# Altium schematic sheet sensors.SchDoc
size Letter
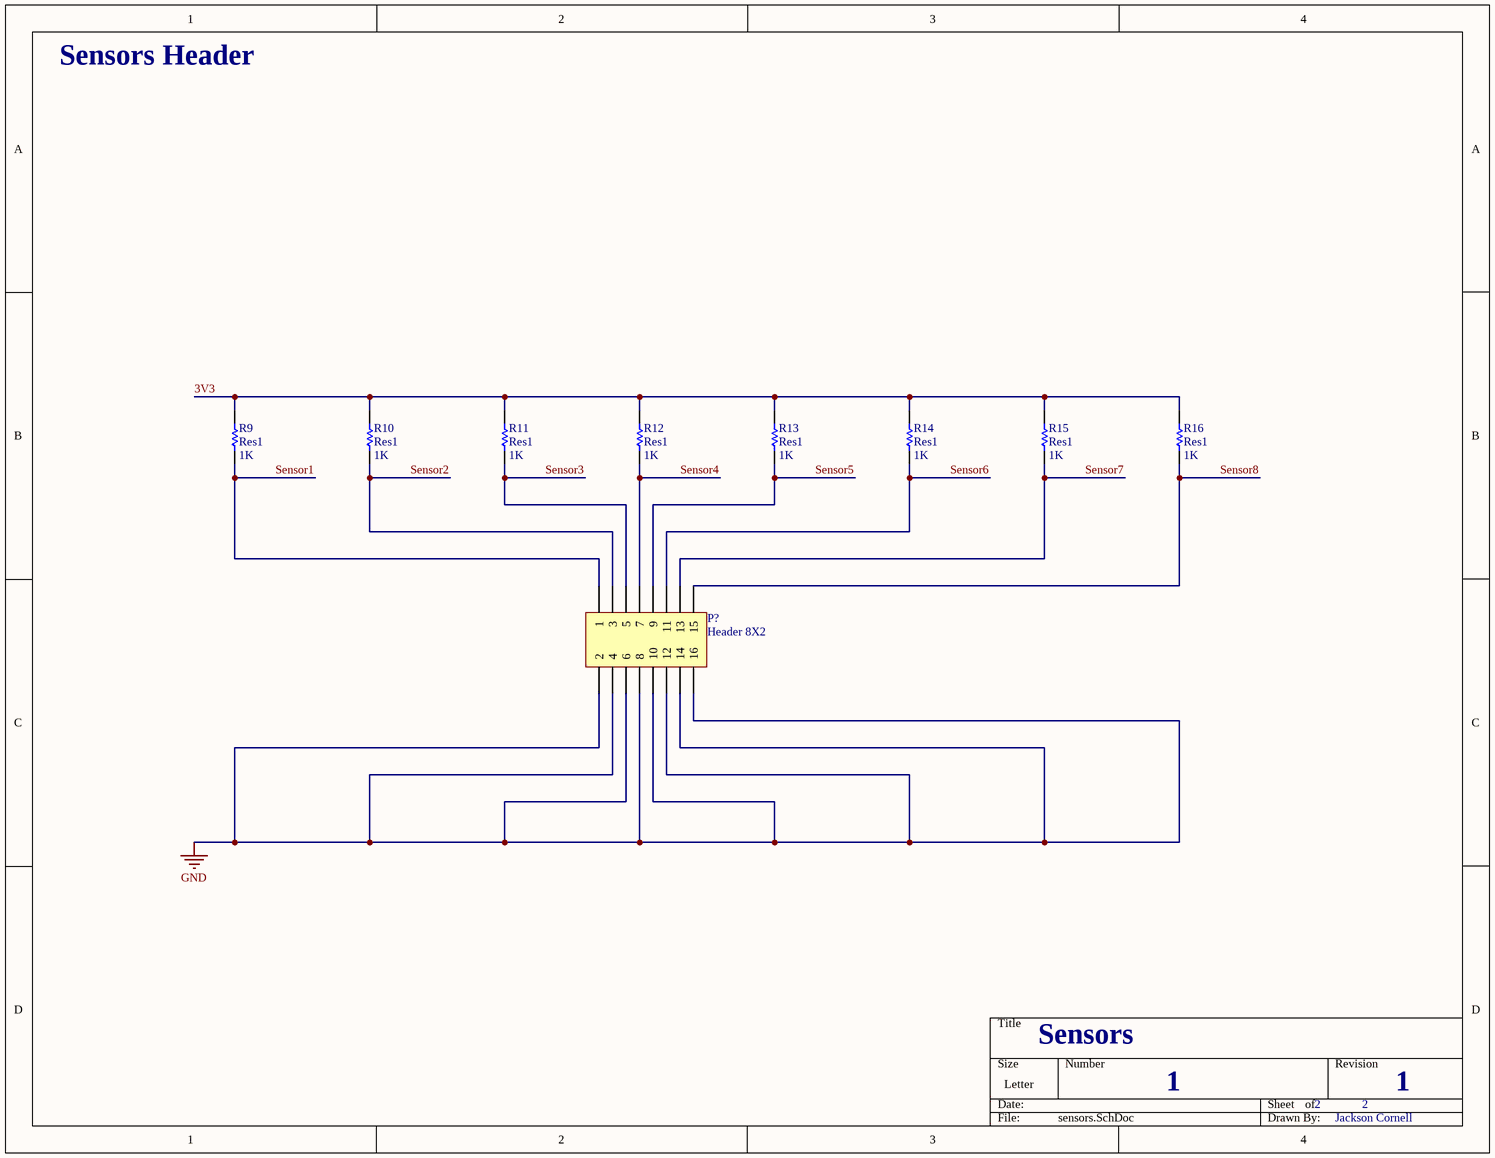
[diagram p0: sensors.SchDoc]

## Parts
P?  Header 8X2  [HDR2X8]
R9  Res1  value 1K  [AXIAL-0.3]
R10  Res1  value 1K  [AXIAL-0.3]
R11  Res1  value 1K  [AXIAL-0.3]
R12  Res1  value 1K  [AXIAL-0.3]
R13  Res1  value 1K  [AXIAL-0.3]
R14  Res1  value 1K  [AXIAL-0.3]
R15  Res1  value 1K  [AXIAL-0.3]
R16  Res1  value 1K  [AXIAL-0.3]

## Nets
GND: P?.2 P?.4 P?.6 P?.8 P?.10 P?.12 P?.14 P?.16
3V3: R9.2 R10.2 R11.2 R12.2 R13.2 R14.2 R15.2 R16.2
Sensor1: P?.1 R9.1
Sensor2: P?.3 R10.1
Sensor3: P?.5 R11.1
Sensor4: P?.7 R12.1
Sensor5: P?.9 R13.1
Sensor6: P?.11 R14.1
Sensor7: P?.13 R15.1
Sensor8: P?.15 R16.1

## Notes on the sheet
- Sensors Header
- Sensors
- 1
- 2
- Jackson Cornell

## Library data of the parts
P? = Header 8X2: Header, 8-Pin, Dual row; LatestRevisionDate: 17-Jul-2002; LatestRevisionNote: Re-released for DXP Platform.; Publisher: Altium Limited
R9-R16 = Res1: Resistor; Published: 8-Jun-2000; LatestRevisionDate: 17-Jul-2002; LatestRevisionNote: Re-released for DXP Platform.; PackageReference: AXIAL-0.3; Publisher: Altium Limited; PackageDescription: Axial Device, Thru-Hole; 2 Leads; 0.3 in Pin Spacing